# Altium project BMS.PrjPcb
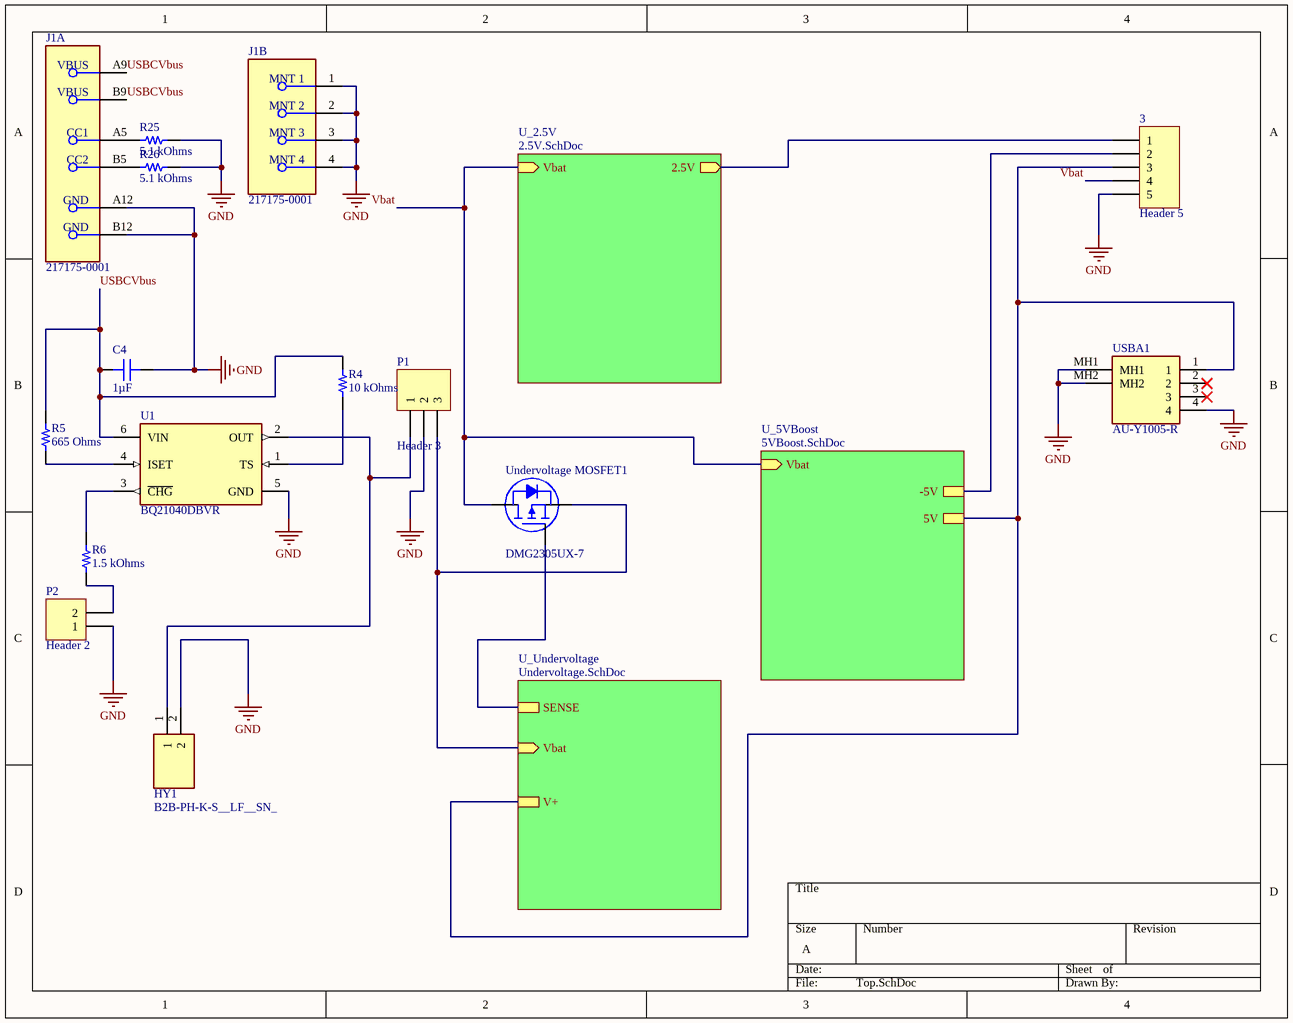
[diagram p0: Top.SchDoc]
4 sheets, 40 parts. Net scope: hierarchical (ports join the sheet entries above them; power ports are global).
Board file: PCB1.PcbDoc
Sheets:
  Top.SchDoc
    U_5VBoost = 5VBoost.SchDoc
    U_Undervoltage = Undervoltage.SchDoc
    U_2.5V = 2.5V.SchDoc

## Sheet Top.SchDoc
size A; SheetNumber: 1; SheetTotal: 4

### Parts
3  Header 5  [HDR1X5]
C4  value 1µF  [CAP 0603_1608]  (hidden comment: 0603YC105MAT2A)
HY1  B2B-PH-K-S__LF__SN_  [B2BPHKSLFSN]
J1  217175-0001  [FP-217175-0001-MFG]  (parts A,B of 2)
P1  Header 3  [HDR1X3]
P2  Header 2  [HDR1X2]
R4  value 10 kOhms  [RES 0603_1608]  (hidden comment: RR0816P-103-D)
R5  value 665 Ohms  [RES 0603_1608]  (hidden comment: RK73H1JTTD6650F)
R6  value 1.5 kOhms  [RES 0603_1608]  (hidden comment: ERA-3AEB152V)
R25  value 5.1 kOhms  [RES 0603_1608]  (hidden comment: AC0603JR-075K1L)
R26  value 5.1 kOhms  [RES 0603_1608]  (hidden comment: AC0603JR-075K1L)
U1  BQ21040DBVR  [FP-DBV0006A-MFG]
Undervoltage_MOSFET1  DMG2305UX-7  [DIODES SOT-23-3]
USBA1  AU-Y1005-R  [AUY1005R]

### Sub-sheets
U_2.5V = 2.5V.SchDoc: Vbat (in), 2.5V (out)
U_5VBoost = 5VBoost.SchDoc: Vbat (in), 5V, -5V
U_Undervoltage = Undervoltage.SchDoc: Vbat (in), SENSE, V+

### Nets
GND: 3.5 C4.2 HY1.2 J1.1(MNT_1) J1.2(MNT_2) J1.3(MNT_3) J1.4(MNT_4) J1.A12(GND) J1.B12(GND) P1.2 P2.1 R25.2 R26.2 U1.5(GND) USBA1.4 USBA1.MH1 USBA1.MH2
USBCVbus: C4.1 J1.A9(VBUS) J1.B9(VBUS) R4.1 R5.2 U1.6(VIN)
Vbat: 3.4 Undervoltage_MOSFET1.3(D) ; sheet U_5VBoost/Vbat, sheet U_2.5V/Vbat
Vout: 3.3 USBA1.1 ; sheet U_5VBoost/5V, sheet U_Undervoltage/V+
Net2.5VBoost_6: 3.1 ; sheet U_2.5V/2.5V
Net3_2: 3.2 ; sheet U_5VBoost/-5V
NetHY1_1: HY1.1 P1.1 U1.2(OUT)
NetJ1_A5: J1.A5(CC1) R25.1
NetJ1_B5: J1.B5(CC2) R26.1
NetP1_3: P1.3 Undervoltage_MOSFET1.2(S) ; sheet U_Undervoltage/Vbat
NetP2_2: P2.2 R6.1
NetR1_1: Undervoltage_MOSFET1.1(G) ; sheet U_Undervoltage/SENSE
NetR4_2: R4.2 U1.1(TS)
NetR5_1: R5.1 U1.4(ISET)
NetR6_2: R6.2 U1.3(~{CHG})

Not connected (* = marked no-connect by the designer): USBA1 2* 3*

### Library data of the parts
3 = CMP-002-000102-1: Header, 5-Pin; Signal Integrity: Connector; LatestRevisionDate: 17-Jul-2002; Source: Miscellaneous Connectors.SchLib; Design Item ID: Header 5; Publisher: Altium Limited; LatestRevisionNote: Re-released for DXP Platform.; Component Type: Standard; Pin Count: 5
C4 = CMP-184-001549-1: CAP CER 1UF 16V X7R 0603; manufacturer: AVX Corporation; Tolerance: ±20%; Part Status: Active; Applications: General Purpose; Operating Temperature: -55°C ~ 125°C; Minimum Order: 1; ComponentLink1URL: http://datasheets.avx.com/X7RDielectric.pdf; partid: 8799; series: -; Mounting Type: Surface Mount, MLCC; Size / Dimension: 0.063" L x 0.032" W (1.60mm x 0.81mm); lastupdated: 9/2/2020 1:03:24 AM; ComponentLink2Description: DigiKey Link; packaging: TapeAndReel; Capacitance: 1µF; price: 0.04; Device Package: 0603 (1608 Metric); Thickness (Max): 0.035" (0.90mm); Voltage - Rated: 16V; ComponentLink1Description: Datasheet; Part Number: 0603YC105MAT2A; Temperature Coefficient: X7R; Package / Case: 0603 (1608 Metric); ComponentLink2URL: http://digikey.com/product-detail/en/avx-corporation/0603YC105MAT2A/478-11645-1-ND/8564203; Lifecycle Status: Active
HY1 = B2B-PH-K-S__LF__SN_: Circulator or Directional Coupler; Manufacturer_Name: JST (JAPAN SOLDERLESS TERMINALS); Manufacturer_Part_Number: B2B-PH-K-S (LF)(SN); Datasheet Link: http://www.jst-mfg.com/product/pdf/eng/ePH.pdf; Height: 6mm
J1 = CMP-04767-000026-1: CONN RCP USB2.0 C 6+18P SMD RA
P1 = CMP-002-000090-1: Header, 3-Pin; Signal Integrity: Connector; Component Type: Standard; LatestRevisionDate: 17-Jul-2002; Publisher: Altium Limited; Design Item ID: Header 3; LatestRevisionNote: Re-released for DXP Platform.; Source: Miscellaneous Connectors.SchLib; Pin Count: 3
P2 = CMP-002-000070-1: Header, 2-Pin; Signal Integrity: Connector; Pin Count: 2; Component Type: Standard; Publisher: Altium Limited; Source: Miscellaneous Connectors.SchLib; LatestRevisionDate: 17-Jul-2002; Design Item ID: Header 2; LatestRevisionNote: Re-released for DXP Platform.
R4 = CMP-289-000281-1: RES SMD 10K OHM 0.5% 1/16W 0603; Manufacturer: Susumu; Power (Watts): 0.063W, 1/16W; Temperature Coefficient: ±25ppm/°C; Device Package: 0603 (1608 Metric); Resistance: 10 kOhms; Number of Terminations: 2; Height - Seated (Max): 0.020" (0.50mm); Composition: Thin Film; Size / Dimension: 0.063" L x 0.031" W (1.60mm x 0.80mm); Series: RR; PartId: 5458; Supplier Device Package: 0603; Part Number: RR0816P-103-D; ComponentLink1Description: Datasheet; Minimum Order: 1; Packaging: TapeAndReel; ComponentLink1URL: http://www.susumu.co.jp/common/pdf/n_catalog_partition05_en.pdf; ComponentLink2URL: https://www.digikey.com/en/products/detail/susumu/RR0816P-103-D/432209; Price: 0.01; LastUpdated: 9/19/2022 1:22:32 PM; Package / Case: 0603 (1608 Metric); Tolerance: ±0.5%; ComponentLink2Description: DigiKey Link; Lifecycle Status: Active; Part Status: Active; Operating Temperature: -55°C ~ 125°C
R5 = CMP-289-001928-1: RES 665 OHM 1% 1/8W 0603; Manufacturer: KOA Speer Electronics, Inc.; Temperature Coefficient: ±100ppm/°C; Power (Watts): 0.125W, 1/8W; Price: 0.01; Minimum Order: 1; Part Status: Active; Composition: Thick Film; Series: RK73H; Operating Temperature: -55°C ~ 155°C; Package / Case: 0603 (1608 Metric); Lifecycle Status: Active; Supplier Device Package: 0603; Height - Seated (Max): 0.022" (0.55mm); Features: Automotive AEC-Q200, Moisture Resistant; Resistance: 665 Ohms; Part Number: RK73H1JTTD6650F; Tolerance: ±1%; Packaging: CutTape; ComponentLink2URL: https://www.digikey.com/en/products/detail/koa-speer-electronics-inc/RK73H1JTTD6650F/9845256; Number of Terminations: 2; LastUpdated: 9/19/2022 1:22:19 PM; Ratings: AEC-Q200; ComponentLink1URL: http://www.koaspeer.com/catimages/Products/RK73H/RK73H.pdf; PartId: 8803; ComponentLink1Description: Datasheet; Device Package: 0603 (1608 Metric); Size / Dimension: 0.063" L x 0.031" W (1.60mm x 0.80mm); ComponentLink2Description: DigiKey Link
R6 = CMP-289-000334-1: RES SMD 1.5K OHM 0.1% 1/10W 0603; Manufacturer: Panasonic Electronic Components; Temperature Coefficient: ±25ppm/°C; Power (Watts): 0.1W, 1/10W; Operating Temperature: -55°C ~ 155°C; Height - Seated (Max): 0.022" (0.55mm); Price: 0.03; Features: Automotive AEC-Q200; Size / Dimension: 0.063" L x 0.031" W (1.60mm x 0.80mm); Lifecycle Status: Active; Supplier Device Package: 0603; Device Package: 0603 (1608 Metric); LastUpdated: 9/19/2022 1:22:32 PM; ComponentLink2Description: DigiKey Link; Tolerance: ±0.1%; Part Number: ERA-3AEB152V; Package / Case: 0603 (1608 Metric); Ratings: AEC-Q200; ComponentLink1Description: Datasheet; Packaging: TapeAndReel; Number of Terminations: 2; ComponentLink1URL: https://industrial.panasonic.com/cdbs/www-data/pdf/RDM0000/AOA0000C307.pdf; Resistance: 1.5 kOhms; Minimum Order: 1; PartId: 5573; ComponentLink2URL: https://www.digikey.com/en/products/detail/panasonic-electronic-components/ERA-3AEB152V/1465858; Composition: Thin Film; Part Status: Active; Series: ERA-3A
R25 R26 = CMP-289-001699-1: RES SMD 5.1K OHM 5% 1/10W 0603; Manufacturer: Yageo; Temperature Coefficient: ±100ppm/°C; Power (Watts): 0.1W, 1/10W; Ratings: AEC-Q200; ComponentLink2Description: DigiKey Link; Packaging: CutTape; Lifecycle Status: Active; Part Number: AC0603JR-075K1L; Resistance: 5.1 kOhms; Supplier Device Package: 0603; LastUpdated: 9/19/2022 1:22:21 PM; ComponentLink2URL: https://www.digikey.com/en/products/detail/yageo/AC0603JR-075K1L/5896480; ComponentLink1URL: https://www.yageo.com/upload/media/product/productsearch/datasheet/rchip/PYu-AC_51_RoHS_L_7.pdf; Part Status: Active; Composition: Thick Film; ComponentLink1Description: Datasheet; Package / Case: 0603 (1608 Metric); Device Package: 0603 (1608 Metric); Height - Seated (Max): 0.022" (0.55mm); Tolerance: ±5%; PartId: 8336; Minimum Order: 1; Price: 0.01; Operating Temperature: -55°C ~ 155°C; Number of Terminations: 2; Series: AC; Features: Automotive AEC-Q200, Moisture Resistant; Size / Dimension: 0.063" L x 0.031" W (1.60mm x 0.80mm)
U1 = CMP-04911-000045-1: IC BATT CHG LI-ION 1CELL SOT23-6; Differential Output: No; Settling Time: 30us; Fault Protection: Over Voltage; Number of Bits: 16; Output Type: Analog Current/Voltage; Interface: USB; Number of Cells: 1; Max Supply Voltage: 6.45V; Battery Pack Voltage: 4.2V; Max Charge Current: 800mA; Number of D/A Converters: 4; Mount: Surface Mount; Case/Package: SOT-23-6; RoHS Compliant: Yes; Packaging: Cut Tape; Min Operating Temperature: 0°C; Lead Free: Lead Free; Max Operating Temperature: 125°C
Undervoltage_MOSFET1 = CMP-258-000005-1: MOSFET P-CH 20V 4.2A SOT23; Manufacturer: Diodes Incorporated; Vgs(th) (Max) @ Id: 900mV @ 250µA; Drive Voltage (Max Rds On,  Min Rds On): 1.8V, 4.5V; Power Dissipation (Max): 1.4W (Ta); Rds On (Max) @ Id, Vgs: 52mOhm @ 4.2A, 4.5V; Vgs (Max): ±8V; Input Capacitance (Ciss) (Max) @ Vds: 808pF @ 15V; Current - Continuous Drain (Id) @ 25°C: 4.2A (Ta); Gate Charge (Qg) (Max) @ Vgs: 10.2nC @ 4.5V; FET Type: P-Channel; Minimum Order: 1; Part Number: DMG2305UX-7; Supplier Device Package: SOT-23; Price: 0.07; Drain to Source Voltage (Vdss): 20V; LastUpdated: 9/19/2022 2:00:16 PM; Packaging: TapeAndReel; Mounting Type: Surface Mount; ComponentLink2Description: DigiKey Link; Part Status: Active; ComponentLink2URL: http://digikey.com/product-detail/en/diodes-incorporated/DMG2305UX-7/DMG2305UX-7DICT-ND/4340665; Package / Case: TO-236-3, SC-59, SOT-23-3; Series: -; Lifecycle Status: Active; Technology: MOSFET (Metal Oxide); ComponentLink1URL: https://www.diodes.com/assets/Datasheets/DMG2305UX.pdf; Operating Temperature: -55°C ~ 150°C (TJ); ComponentLink1Description: Datasheet
USBA1 = AU-Y1005-R: Connector; Manufacturer_Name: ASSMANN WSW components GmbH; Datasheet Link: http://media.digikey.com/pdf/Data%20Sheets/Assmann%20PDFs/AU-Y1005-R_Dwg.pdf; Height: 7.8mm; Manufacturer_Part_Number: AU-Y1005-R

## Sheet 5VBoost.SchDoc
size A; SheetNumber: 2; SheetTotal: 4
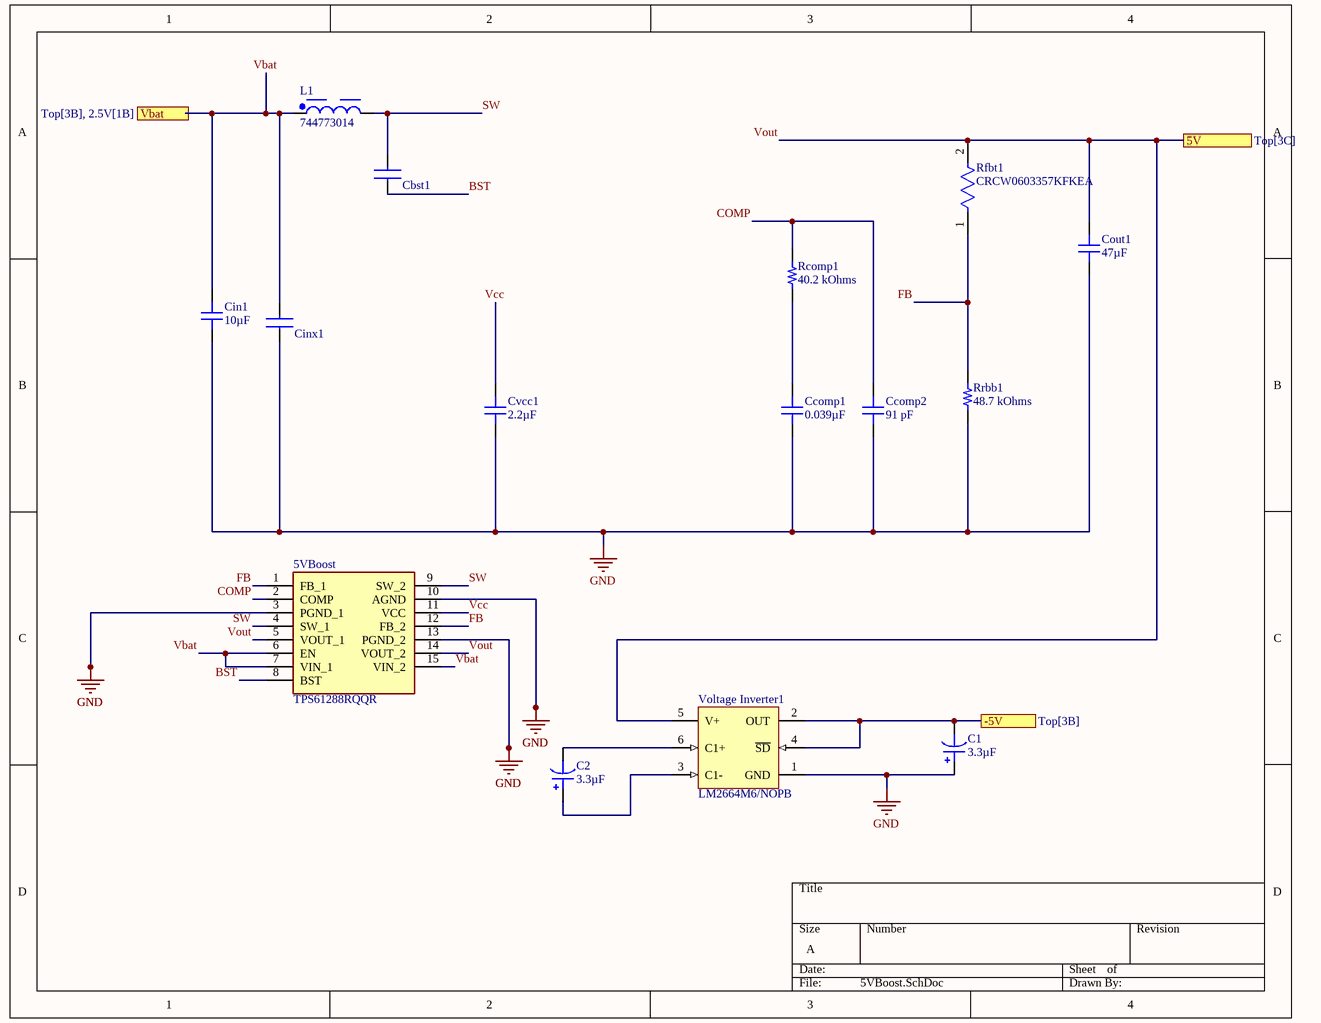
[diagram p1: 5VBoost.SchDoc]

### Parts
5VBoost  TPS61288RQQR  [TPS61288RQQR]
C1  value 3.3µF  [CAP POL 1411_3528]  (hidden comment: SCTB335K16)
C2  value 3.3µF  [CAP POL 1411_3528]  (hidden comment: SCTB335K16)
Cbst1  Capacitor 100nF 0603  [CAPC1608X90N]  (value not drawn)
Ccomp1  value 0.039µF  [CAP 0603_1608]  (hidden comment: 06035C393JAT2A)
Ccomp2  value 91 pF  [CAP 0603_1608]  (hidden comment: C0603C910J1GAC7867)
Cin1  value 10µF  [CAP 0603_1608]  (hidden comment: 06036D106KAT2A)
Cinx1  Capacitor 100nF 0603  [CAPC1608X90N]  (value not drawn)
Cout1  value 47µF  [CAP 0603_1608]  (hidden comment: 06036D476MAT2A)
Cvcc1  value 2.2µF  [CAP 0603_1608]  (hidden comment: 0603YD225KAT2A)
L1  744773014  [WE-PD2_4532]
Rcomp1  value 40.2 kOhms  [RES 0603_1608]  (hidden comment: RT0603DRE0740K2L)
Rfbt1  CRCW0603357KFKEA  [FP-CRCW0603-e3-IPC_C]
Rrbb1  value 48.7 kOhms  [RES 0603_1608]  (hidden comment: CPF0603F48K7C1)
Voltage_Inverter1  LM2664M6/NOPB  [DBV0006A_L]

### Ports
5V (see Top[3C]), -5V (see Top[3B]), Vbat (in, see Top[3B], 2.5V[1B])

### Nets
GND: 5VBoost.3(PGND_1) 5VBoost.10(AGND) 5VBoost.13(PGND_2) C1.1 Ccomp1.1 Ccomp2.1 Cin1.1 Cinx1.1 Cout1.1 Cvcc1.1 Rrbb1.1 Voltage_Inverter1.1(GND)
BST: 5VBoost.8(BST) Cbst1.1
COMP: 5VBoost.2(COMP) Ccomp2.2 Rcomp1.2
FB: 5VBoost.1(FB_1) 5VBoost.12(FB_2) Rfbt1.1 Rrbb1.2
SW: 5VBoost.4(SW_1) 5VBoost.9(SW_2) Cbst1.2 L1.2
Vbat: 5VBoost.6(EN) 5VBoost.7(VIN_1) 5VBoost.15(VIN_2) Cin1.2 Cinx1.2 L1.1 ; port Vbat
Vcc: 5VBoost.11(VCC) Cvcc1.2
Vout: 5VBoost.5(VOUT_1) 5VBoost.14(VOUT_2) Cout1.2 Rfbt1.2 Voltage_Inverter1.5(V+) ; port 5V
Net3_2: C1.2 Voltage_Inverter1.2(OUT) Voltage_Inverter1.4(~{SD}) ; port -5V
NetC2_1: C2.1 Voltage_Inverter1.3(C1-)
NetC2_2: C2.2 Voltage_Inverter1.6(C1+)
NetCcomp1_2: Ccomp1.2 Rcomp1.1

### Library data of the parts
5VBoost = TPS61288RQQR: Integrated Circuit; Manufacturer_Name: Texas Instruments; Datasheet Link: https://www.ti.com/lit/ds/symlink/tps61288.pdf?ts=1609351344517&ref_url=https%253A%252F%252Fwww.ti.com%252Fpower-management%252Fnon-isolated-dc-dc-switching-regulators%252Fstep-up-boost%252Fboost-converters-integrated-switch%252Fproducts.html; Height: 1mm; Manufacturer_Part_Number: TPS61288RQQR; Mouser Part Number: 595-TPS61288RQQR; Mouser Price/Stock: https://www.mouser.co.uk/ProductDetail/Texas-Instruments/TPS61288RQQR?qs=eP2BKZSCXI7ZX8saYJkaIw%3D%3D; Arrow Part Number: TPS61288RQQR; Arrow Price/Stock: https://www.arrow.com/en/products/tps61288rqqr/texas-instruments?utm_currency=USD&region=nac
C1 C2 = CMP-192-003656-1: CAP-TANT SM 3.3UF 16V; Manufacturer Size Code: B; manufacturer: NTE Electronics, Inc; Tolerance: ±10%; Type: Molded; series: SCT; Size / Dimension: 0.138" L x 0.110" W (3.50mm x 2.80mm); ComponentLink2URL: http://digikey.com/product-detail/en/nte-electronics-inc/SCTB335K16/2368-SCTB335K16-ND/11646299; lastupdated: 8/30/2020 8:55:00 PM; Features: General Purpose; price: 0.56; Mounting Type: Surface Mount; packaging: Bag; ComponentLink1URL: https://www.nteinc.com/capacitor_web/pdf/sct.pdf; partid: 3657; Minimum Order: 5; Height - Seated (Max): 0.083" (2.10mm); ComponentLink2Description: DigiKey Link; Package / Case: 1411 (3528 Metric), 1210; Part Number: SCTB335K16; Lifecycle Status: Active; ComponentLink1Description: Datasheet; Capacitance: 3.3µF
Cbst1 Cinx1 = CMP-002-000221-3: TDK - CGA3E2X7R1H104K080AA Multilayer Ceramic Capacitors MLCC - SMD/SMT CGA 0603 50V 0.1uF X7R 10% AEC-Q200; Manufacturer_Name: TDK; Datasheet Link: https://componentsearchengine.com//CGA3E2X7R1H104K080AA.pdf; Manufacturer_Part_Number: CGA3E2X7R1H104K080AA; Design Item ID: CGA3E2X7R1H104K080AA; Height: 0.9mm; Source: CGA3E2X7R1H104K080AA.SchLib; Mouser2 Price/Stock: https://www.mouser.com/Search/Refine.aspx?Keyword=810-CGA3E2X7R1H104K; Mouser2 Part Number: 810-CGA3E2X7R1H104K
Ccomp1 = CMP-184-000491-1: CAP CER 0.039UF 50V X7R 0603; manufacturer: AVX Corporation; Tolerance: ±5%; lastupdated: 9/2/2020 1:03:32 AM; Size / Dimension: 0.063" L x 0.032" W (1.60mm x 0.81mm); Part Status: Active; Lifecycle Status: Active; Package / Case: 0603 (1608 Metric); Voltage - Rated: 50V; ComponentLink2Description: DigiKey Link; Part Number: 06035C393JAT2A; ComponentLink2URL: http://digikey.com/product-detail/en/avx-corporation/06035C393JAT2A/478-10354-1-ND/6797293; Capacitance: 0.039µF; Device Package: 0603 (1608 Metric); Temperature Coefficient: X7R; Applications: General Purpose; partid: 4146; series: -; ComponentLink1URL: http://datasheets.avx.com/X7RDielectric.pdf; packaging: TapeAndReel; ComponentLink1Description: Datasheet; Operating Temperature: -55°C ~ 125°C; Thickness (Max): 0.035" (0.90mm); Minimum Order: 1; price: 0.08; Mounting Type: Surface Mount, MLCC
Ccomp2 = CMP-184-001276-1: CAP CER 91PF 100V C0G/NP0 0603; manufacturer: KEMET; Tolerance: ±5%; Temperature Coefficient: C0G, NP0; Lifecycle Status: Active; ComponentLink2URL: https://www.digikey.com/en/products/detail/kemet/C0603C910J1GAC7867/7382113; Mounting Type: Surface Mount, MLCC; ComponentLink2Description: DigiKey Link; Package / Case: 0603 (1608 Metric); series: SMD Comm C0G; ComponentLink1URL: https://api.kemet.com/component-edge/download/datasheet/C0603C910J1GAC7867.pdf; Part Status: Active; partid: 7603; price: 0.06; Minimum Order: 1; lastupdated: 9/19/2022 1:01:05 PM; Part Number: C0603C910J1GAC7867; Voltage - Rated: 100V; Size / Dimension: 0.063" L x 0.031" W (1.60mm x 0.80mm); Features: Low ESL; packaging: TapeAndReel; Capacitance: 91 pF; ComponentLink1Description: Datasheet; Operating Temperature: -55°C ~ 125°C; Applications: General Purpose; Device Package: 0603 (1608 Metric); Thickness (Max): 0.034" (0.87mm)
Cin1 = CMP-184-001573-1: CAP CER 10UF 6.3V X5R 0603; manufacturer: AVX Corporation; Tolerance: ±10%; Part Number: 06036D106KAT2A; lastupdated: 9/2/2020 1:03:24 AM; Voltage - Rated: 6.3V; Part Status: Active; price: 0.45; ComponentLink2URL: http://digikey.com/product-detail/en/avx-corporation/06036D106KAT2A/478-7932-1-ND/3881555; Size / Dimension: 0.063" L x 0.032" W (1.60mm x 0.81mm); ComponentLink1URL: http://datasheets.avx.com/cx5r.pdf; packaging: TapeAndReel; Device Package: 0603 (1608 Metric); partid: 8872; Thickness (Max): 0.035" (0.90mm); series: -; Minimum Order: 1; ComponentLink2Description: DigiKey Link; Capacitance: 10µF; Operating Temperature: -55°C ~ 85°C; Temperature Coefficient: X5R; Package / Case: 0603 (1608 Metric); Applications: General Purpose; ComponentLink1Description: Datasheet; Lifecycle Status: Active; Mounting Type: Surface Mount, MLCC
Cout1 = CMP-184-002058-1: CAP CER 47UF 6.3V X5R 0603; manufacturer: AVX Corporation; Tolerance: ±20%; Part Status: Active; Mounting Type: Surface Mount, MLCC; Minimum Order: 1; packaging: TapeAndReel; ComponentLink2URL: http://digikey.com/product-detail/en/avx-corporation/06036D476MAT2A/478-11180-1-ND/7563130; price: 0.41; lastupdated: 9/2/2020 1:03:20 AM; ComponentLink1URL: http://datasheets.avx.com/cx5r.pdf; Device Package: 0603 (1608 Metric); Voltage - Rated: 6.3V; series: -; ComponentLink2Description: DigiKey Link; ComponentLink1Description: Datasheet; partid: 11014; Size / Dimension: 0.063" L x 0.031" W (1.60mm x 0.80mm); Applications: General Purpose; Temperature Coefficient: X5R; Capacitance: 47µF; Operating Temperature: -55°C ~ 85°C; Part Number: 06036D476MAT2A; Package / Case: 0603 (1608 Metric); Lifecycle Status: Active
Cvcc1 = CMP-184-002158-1: CAP CER 2.2UF 16V X5R 0603; manufacturer: AVX Corporation; Tolerance: ±10%; Device Package: 0603 (1608 Metric); Package / Case: 0603 (1608 Metric); series: -; price: 0.19; Operating Temperature: -55°C ~ 85°C; Part Status: Active; Lifecycle Status: Active; packaging: TapeAndReel; Minimum Order: 1; ComponentLink2Description: DigiKey Link; Voltage - Rated: 16V; Part Number: 0603YD225KAT2A; ComponentLink1Description: Datasheet; partid: 11466; Applications: General Purpose; ComponentLink2URL: http://digikey.com/product-detail/en/avx-corporation/0603YD225KAT2A/478-5147-1-ND/1913237; Mounting Type: Surface Mount, MLCC; Temperature Coefficient: X5R; lastupdated: 9/2/2020 1:03:19 AM; ComponentLink1URL: http://datasheets.avx.com/cx5r.pdf; Thickness (Max): 0.035" (0.90mm); Capacitance: 2.2µF; Size / Dimension: 0.063" L x 0.032" W (1.60mm x 0.81mm)
L1 = CMP-0227-00478-2: NexarPartId: 24533326; Self Resonant Frequency: 103MHz; Inductance: 1.4µH; DC Resistance (DCR): 22mΩ; RMS Current (Irms): 3.4A; Inductance Tolerance: 20%; Saturation Current: 5.04A; Core Material: Ferrite; Test Frequency: 10kHz; Resistance: 56mΩ; Shielding: Unshielded; Min Operating Temperature: -40°C; Length: 4mm; Ambient Temperature Range Low: -40°C; Lead Free: Lead Free; Ambient Temperature Range High: 85°C; Case/Package: Nonstandard; REACH SVHC: Unknown; Width: 4.5mm; Max Operating Temperature: 125°C; Height: 3.2mm; Height - Seated (Max): 3.5052mm; RoHS: Compliant; Mount: Surface Mount; Tolerance: 20%; Composition: Wirewound; Current Rating: 3.4A; Max DC Current: 3.4A; Termination: SMD/SMT; Packaging: Digi-Reel®
Rcomp1 = CMP-289-002489-1: RES SMD 40.2KOHM 0.5% 1/10W 0603; Manufacturer: Yageo; Power (Watts): 0.1W, 1/10W; Temperature Coefficient: ±50ppm/°C; Supplier Device Package: 0603; Height - Seated (Max): 0.022" (0.55mm); Composition: Thin Film; Size / Dimension: 0.063" L x 0.031" W (1.60mm x 0.80mm); Packaging: TapeAndReel; Series: RT; Resistance: 40.2 kOhms; Minimum Order: 1; PartId: 9988; ComponentLink1URL: https://www.yageo.com/upload/media/product/productsearch/datasheet/rchip/PYu-RT_1-to-0.01_RoHS_L_11.pdf; Number of Terminations: 2; Part Number: RT0603DRE0740K2L; Device Package: 0603 (1608 Metric); Price: 0.01; Operating Temperature: -55°C ~ 155°C; ComponentLink2Description: DigiKey Link; Tolerance: ±0.5%; Part Status: Active; ComponentLink2URL: https://www.digikey.com/en/products/detail/yageo/RT0603DRE0740K2L/1074850; LastUpdated: 9/19/2022 1:22:15 PM; Lifecycle Status: Active; ComponentLink1Description: Datasheet; Package / Case: 0603 (1608 Metric)
Rfbt1 = CMP-2000-03262-2: RES Thick Film, 357kΩ, 1%, 0.1W, 100ppm/°C, 0603; Max Power Dissipation: 100mW; Voltage Rating (DC): 75V; Resistance: 357kR; Packaging: Tape and Reel; Min Operating Temperature: -55°C; Max Operating Temperature: 155°C; Number of Pins: 2; Length: 1.55mm; Case Code (Imperial): 0603; Number of Terminations: 2; Military Standard: Not; Width: 0.033inch; Case Code (Metric): 1608; Termination: Solder; Radiation Hardening: No; Power Rating: 100mW; Depth: 0.85mm; Voltage Rating: 75V; Height: 0.45mm; Case/Package: 0603; Package Quantity: 10; Composition: Thick Film; Weight: 7.1E-05oz; Features: Automotive AEC-Q200; Lead Free: Lead Free; Tolerance: 1%; Temperature Coefficient: 100ppm/°C; Contact Plating: Tin
Rrbb1 = CMP-289-001065-1: RES SMD 48.7K OHM 1% 1/16W 0603; Manufacturer: TE Connectivity Passive Product; Temperature Coefficient: ±50ppm/°C; Power (Watts): 0.063W, 1/16W; ComponentLink2Description: DigiKey Link; ComponentLink1Description: Datasheet; Tolerance: ±1%; PartId: 7053; Composition: Thin Film; Size / Dimension: 0.061" L x 0.031" W (1.55mm x 0.80mm); Operating Temperature: -55°C ~ 155°C; LastUpdated: 9/19/2022 1:22:26 PM; Part Number: CPF0603F48K7C1; Resistance: 48.7 kOhms; Price: 0.02; Part Status: Active; Height - Seated (Max): 0.022" (0.55mm); Device Package: 0603 (1608 Metric); Series: CPF, Neohm; Package / Case: 0603 (1608 Metric); Number of Terminations: 2; Minimum Order: 1; Lifecycle Status: Active; Packaging: TapeAndReel; Supplier Device Package: 0603; ComponentLink2URL: https://www.digikey.com/en/products/detail/te-connectivity-passive-product/CPF0603F48K7C1/2384648; ComponentLink1URL: https://www.te.com/commerce/DocumentDelivery/DDEController?Action=srchrtrv&DocNm=1773200&DocType=DS&DocLang=English
Voltage_Inverter1 = CMP-0065-00094-3: Switched Capacitor Voltage Converter, 6-pin SOT-23, Pb-Free; Manufacturer: Texas Instruments; PackageTopMarking: S03A*XTT; CompType: Switch Caps; PowerWise: N; PackageDescription: Molded SOT-23, .115 x .063 x .040in Body, 6 Lead, .0375in in Pitch; PackageReference: DBV0006A; ComponentLink1URL: http://www.ti.com/general/docs/lit/getliterature.tsp?genericPartNumber=LM2664&fileType=pdf; ComponentLink1Description: Datasheet URL; Code_IPC: SOT26A-6; RoHS: Y; PinCount: 6; Code_JEDEC: MO-178-AB

## Sheet Undervoltage.SchDoc
size A; SheetNumber: 4; SheetTotal: 4
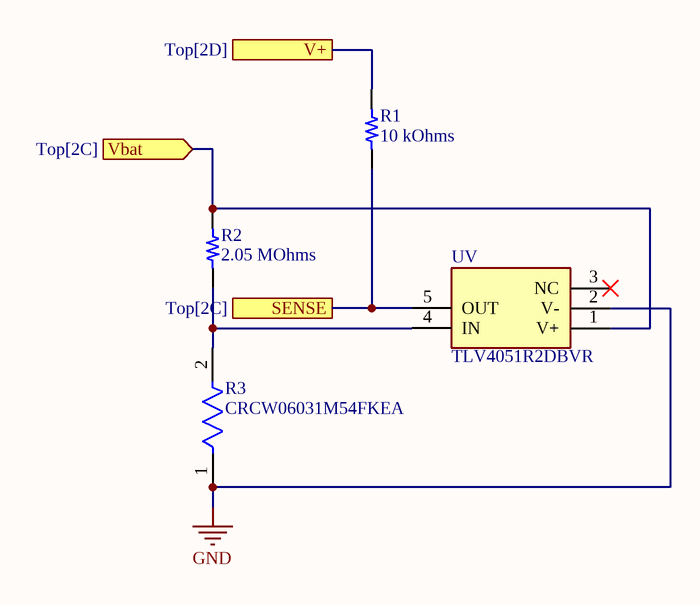
[diagram p2: Undervoltage.SchDoc]

### Parts
R1  value 10 kOhms  [RES 0603_1608]  (hidden comment: RR0816P-103-D)
R2  value 2.05 MOhms  [RES 0603_1608]  (hidden comment: RMCF0603FT2M05)
R3  CRCW06031M54FKEA  [FP-CRCW0603-e3-IPC_B]
UV  TLV4051R2DBVR  [SOT95P280X145-5N]

### Ports
SENSE (see Top[2C]), V+ (see Top[2D]), Vbat (in, see Top[2C])

### Nets
GND: R3.1 UV.2(V-)
Vout: R1.2 ; port V+
NetP1_3: R2.2 UV.1(V+) ; port Vbat
NetR1_1: R1.1 UV.5(OUT) ; port SENSE
NetR2_1: R2.1 R3.2 UV.4(IN)

Not connected (* = marked no-connect by the designer): UV 3(NC)*

### Library data of the parts
R1 = CMP-289-000281-1: as R4 on sheet Top; Device Package: 0603 (1608 Metric); Resistance: 10 kOhms; Number of Terminations: 2; Height - Seated (Max): 0.020" (0.50mm); Composition: Thin Film; Size / Dimension: 0.063" L x 0.031" W (1.60mm x 0.80mm); Series: RR; PartId: 5458; Supplier Device Package: 0603; Part Number: RR0816P-103-D; ComponentLink1Description: Datasheet; Minimum Order: 1; Packaging: TapeAndReel; ComponentLink1URL: http://www.susumu.co.jp/common/pdf/n_catalog_partition05_en.pdf; ComponentLink2URL: https://www.digikey.com/en/products/detail/susumu/RR0816P-103-D/432209; Price: 0.01; LastUpdated: 9/19/2022 1:22:32 PM; Package / Case: 0603 (1608 Metric); Tolerance: ±0.5%; ComponentLink2Description: DigiKey Link; Lifecycle Status: Active; Part Status: Active; Operating Temperature: -55°C ~ 125°C
R2 = CMP-289-001020-1: RES 2.05M OHM 1% 1/10W 0603; Manufacturer: Stackpole Electronics Inc; Power (Watts): 0.1W, 1/10W; Temperature Coefficient: ±200ppm/°C; Series: RMCF; Part Number: RMCF0603FT2M05; Lifecycle Status: Active; Device Package: 0603 (1608 Metric); Number of Terminations: 2; ComponentLink2Description: DigiKey Link; Price: 0.01; Minimum Order: 1; Part Status: Active; Resistance: 2.05 MOhms; Ratings: AEC-Q200; PartId: 6967; Features: Automotive AEC-Q200; ComponentLink2URL: https://www.digikey.com/en/products/detail/stackpole-electronics-inc/RMCF0603FT2M05/1713706; LastUpdated: 9/19/2022 1:22:26 PM; ComponentLink1URL: https://www.seielect.com/catalog/sei-rmcf_rmcp.pdf; Composition: Thick Film; ComponentLink1Description: Datasheet; Supplier Device Package: 0603; Size / Dimension: 0.061" L x 0.031" W (1.55mm x 0.80mm); Height - Seated (Max): 0.022" (0.55mm); Package / Case: 0603 (1608 Metric); Operating Temperature: -55°C ~ 155°C; Packaging: CutTape; Tolerance: ±1%
R3 = CMP-02407-002537-1: RES Thick Film, 1.54MΩ, 1%, 0.1W, 100ppm/°C, 0603; Voltage Rating: 75V; Max Power Dissipation: 100mW; Resistance: 1.54MR; Min Operating Temperature: -55°C; Height: 0.02inch; Composition: Thick Film; Weight: 7.1E-05oz; Width: 0.85mm; Depth: 0.85mm; Case Code (Imperial): 0603; Power Rating: 100mW; Contact Plating: Tin; Packaging: Tape and Reel; Lead Free: Lead Free; Length: 1.55mm; Tolerance: 1%; Package Quantity: 10; Temperature Coefficient: 100ppm/°C; Features: Automotive AEC-Q200; Case/Package: 0603; Military Standard: Not; Number of Pins: 2; Termination: SMD/SMT; Number of Terminations: 2; Max Operating Temperature: 155°C; Case Code (Metric): 1608; Radiation Hardening: No; Voltage Rating (DC): 75V
UV = TLV4051R2DBVR: Integrated Circuit; Manufacturer_Name: Texas Instruments; Datasheet Link: https://www.ti.com/product/TLV4051; Height: 1.45mm; Manufacturer_Part_Number: TLV4051R2DBVR

## Sheet 2.5V.SchDoc
size A; SheetNumber: 3; SheetTotal: 4
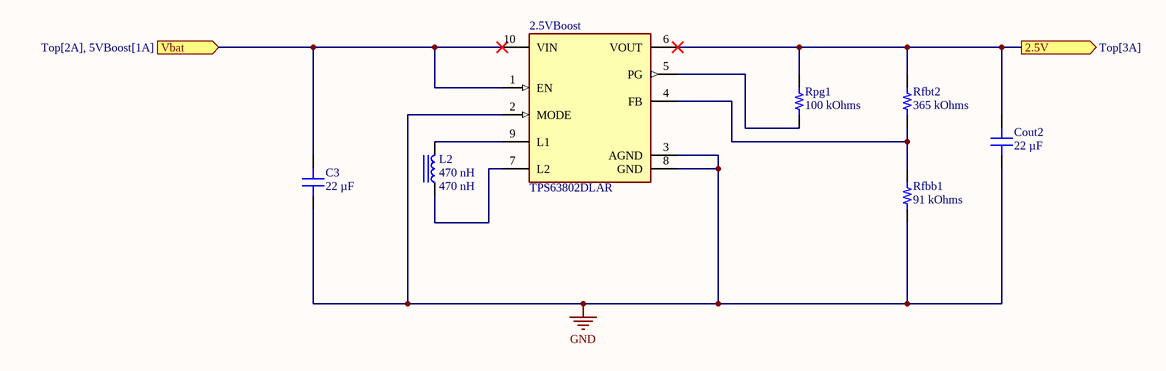
[diagram p3: 2.5V.SchDoc]

### Parts
2.5VBoost  TPS63802DLAR  [FP-DLA0010A-MFG]
C3  value 22 µF  [CAP 0603_1608]  (hidden comment: CL10A226MPCNUBE)
Cout2  value 22 µF  [CAP 0603_1608]  (hidden comment: CL10A226MPCNUBE)
L2  value 470 nH  [BOURNS SRP5030T]  (hidden comment: SRP5030T-R47M)
Rfbb1  value 91 kOhms  [RES 0603_1608]  (hidden comment: ERJ-PA3F9102V)
Rfbt2  value 365 kOhms  [RES 0603_1608]  (hidden comment: RC0603FR-07365KL)
Rpg1  value 100 kOhms  [RES 0603_1608]  (hidden comment: RK73B1JTTD104J)

### Ports
2.5V (out, see Top[3A]), Vbat (in, see Top[2A], 5VBoost[1A])

### Nets
GND: 2.5VBoost.2(MODE) 2.5VBoost.3(AGND) 2.5VBoost.8(GND) C3.1 Cout2.1 Rfbb1.1
Vbat: 2.5VBoost.1(EN) 2.5VBoost.10(VIN) C3.2 ; port Vbat
Net2.5VBoost_4: 2.5VBoost.4(FB) Rfbb1.2 Rfbt2.1
Net2.5VBoost_5: 2.5VBoost.5(PG) Rpg1.1
Net2.5VBoost_6: 2.5VBoost.6(VOUT) Cout2.2 Rfbt2.2 Rpg1.2 ; port 2.5V
Net2.5VBoost_7: 2.5VBoost.7(L2) L2.1
Net2.5VBoost_9: 2.5VBoost.9(L1) L2.2

### Library data of the parts
2.5VBoost = CMP-04918-000005-1: IC POWER MANAGEMENT; Manufacturer: Texas Instruments; Nominal Supply Current: 11uA; Max Junction Temp: +125°C; Max Supply Voltage: 5.5V; Switching Topology: Buck-Boost; Min Supply Voltage: 1.3V; Output Current: 2A; Output Voltage: 1.8-5.2V; Number Of Outputs: 1; Switching Frequency: 1.4/1.6/2.1MHz; Description: 2-A, High-efficient, Low IQ Buck-boost Converter in DFN Package; Standoff Height: 0mm; Max Duty Cycle: 100%; Output Type: AdjustableProgrammable; Manufacturer Part Number: TPS63802DLAR; ComponentLink2URL: https://www.ti.com/lit/ds/symlink/tps63802.pdf; Digikey Description: IC POWER MANAGEMENT; Octopart: https://octopart.com/tps63802dlar-texas+instruments-97359678; Height: 1mm; Temperature: -40°C to +125°C; Device Class L3: Voltage Regulators - Switching; Lead Free: Yes; Category: IC; Mouser Description: 2-A, high-efficient, 11-µA quiescent current buck-boost converter in QFN/DFN package 10-VSON-HR -40 to 125; ComponentLink2Description: Datasheet; Temperature Range Low: -40°C; Temperature Range High: +125°C; Automotive: No; Device Class L2: Power Management ICs; RoHS: TRUE; Device Class L1: Integrated Circuits (ICs); Package: DLA0010A
C3 Cout2 = CMP-184-000455-1: CAP CER 22UF 10V X5R 0603; manufacturer: Samsung Electro-Mechanics; Tolerance: ±20%; series: CL; Applications: General Purpose; Operating Temperature: -55°C ~ 85°C; Mounting Type: Surface Mount, MLCC; Thickness (Max): 0.037" (0.95mm); ComponentLink2Description: DigiKey Link; Lifecycle Status: Active; Size / Dimension: 0.063" L x 0.031" W (1.60mm x 0.80mm); partid: 3985; lastupdated: 9/19/2022 1:01:15 PM; Device Package: 0603 (1608 Metric); ComponentLink2URL: https://www.digikey.com/en/products/detail/samsung-electro-mechanics/CL10A226MPCNUBE/5960988; Temperature Coefficient: X5R; Package / Case: 0603 (1608 Metric); price: 0.06; Part Status: Active; Part Number: CL10A226MPCNUBE; Capacitance: 22 µF; packaging: TapeAndReel; Minimum Order: 1; Voltage - Rated: 10V; ComponentLink1Description: Datasheet; ComponentLink1URL: http://www.samsungsem.com/kr/support/product-search/mlcc/CL10A226MPCNUBE.jsp
L2 = CMP-236-000004-1: FIXED IND 470NH 12A 7.4 MOHM SMD; Manufacturer: Bourns Inc.; DC Resistance (DCR): 7.4mOhm Max; Inductance Frequency - Test: 100 kHz; Type: Drum Core, Wirewound; Material - Core: Iron Powder; Tolerance: ±20%; Current - Saturation: 16A; Shielding: Shielded; PartId: 5; ComponentLink2Description: DigiKey Link; ComponentLink2URL: https://www.digikey.com/en/products/detail/bourns-inc/SRP5030T-R47M/3986077; Series: SRP5030T; Minimum Order: 1; Part Status: Active; Current Rating (Amps): 12 A; Size / Dimension: 0.224" L x 0.205" W (5.70mm x 5.20mm); ComponentLink1Description: Datasheet; Price: 0.63; Device Package: Nonstandard; Inductance: 470 nH; Height - Seated (Max): 0.118" (3.00mm); ComponentLink1URL: https://www.bourns.com/docs/Product-Datasheets/SRP5030T.pdf; LastUpdated: 9/19/2022 1:52:24 PM; Packaging: TapeAndReel; Lifecycle Status: Active; Package / Case: Nonstandard; Mounting Type: Surface Mount; Part Number: SRP5030T-R47M; Operating Temperature: -40°C ~ 125°C
Rfbb1 = CMP-289-001040-1: RES SMD 91K OHM 1% 1/4W 0603; Manufacturer: Panasonic Electronic Components; Power (Watts): 0.25W, 1/4W; Temperature Coefficient: ±100ppm/°C; Minimum Order: 1; Number of Terminations: 2; ComponentLink1Description: Datasheet; Resistance: 91 kOhms; Series: ERJ-PA3; ComponentLink1URL: https://industrial.panasonic.com/cdbs/www-data/pdf/RDO0000/AOA0000C331.pdf; Part Status: Active; Price: 0.02; ComponentLink2Description: DigiKey Link; Lifecycle Status: Active; Operating Temperature: -55°C ~ 155°C; Ratings: AEC-Q200; LastUpdated: 9/19/2022 1:22:26 PM; Features: Automotive AEC-Q200, Pulse Withstanding; Tolerance: ±1%; PartId: 7007; Size / Dimension: 0.063" L x 0.031" W (1.60mm x 0.80mm); Supplier Device Package: 0603; ComponentLink2URL: https://www.digikey.com/en/products/detail/panasonic-electronic-components/ERJ-PA3F9102V/5035965; Package / Case: 0603 (1608 Metric); Device Package: 0603 (1608 Metric); Packaging: TapeAndReel; Height - Seated (Max): 0.022" (0.55mm); Part Number: ERJ-PA3F9102V; Composition: Thick Film
Rfbt2 = CMP-289-001331-1: RES 365K OHM 1% 1/10W 0603; Manufacturer: Yageo; Temperature Coefficient: ±100ppm/°C; Power (Watts): 0.1W, 1/10W; Size / Dimension: 0.063" L x 0.031" W (1.60mm x 0.80mm); Tolerance: ±1%; ComponentLink1URL: https://www.yageo.com/upload/media/product/productsearch/datasheet/rchip/PYu-RC_Group_51_RoHS_L_10.pdf; Number of Terminations: 2; Series: RC_L; PartId: 7601; Operating Temperature: -55°C ~ 155°C; Resistance: 365 kOhms; Device Package: 0603 (1608 Metric); Part Number: RC0603FR-07365KL; Packaging: CutTape; Package / Case: 0603 (1608 Metric); ComponentLink2Description: DigiKey Link; Composition: Thick Film; Supplier Device Package: 0603; LastUpdated: 9/19/2022 1:22:24 PM; ComponentLink2URL: https://www.digikey.com/en/products/detail/yageo/RC0603FR-07365KL/727185; Lifecycle Status: Active; Height - Seated (Max): 0.022" (0.55mm); ComponentLink1Description: Datasheet; Part Status: Active; Features: Moisture Resistant; Price: 0.01; Minimum Order: 1
Rpg1 = CMP-289-000475-1: RES 100K OHM 5% 1/10W 0603; Manufacturer: KOA Speer Electronics, Inc.; Temperature Coefficient: ±200ppm/°C; Power (Watts): 0.1W, 1/10W; Ratings: AEC-Q200; Series: RK73B; Size / Dimension: 0.063" L x 0.031" W (1.60mm x 0.80mm); Features: Automotive AEC-Q200; ComponentLink2Description: DigiKey Link; Composition: Thick Film; Resistance: 100 kOhms; Tolerance: ±5%; Height - Seated (Max): 0.022" (0.55mm); Minimum Order: 1; ComponentLink1Description: Datasheet; Operating Temperature: -55°C ~ 155°C; Part Number: RK73B1JTTD104J; Supplier Device Package: 0603; Packaging: CutTape; ComponentLink1URL: http://www.koaspeer.com/catimages/Products/RK73B/RK73B.pdf; Part Status: Active; Number of Terminations: 2; LastUpdated: 9/19/2022 1:22:31 PM; Package / Case: 0603 (1608 Metric); Device Package: 0603 (1608 Metric); Price: 0.01; ComponentLink2URL: https://www.digikey.com/en/products/detail/koa-speer-electronics-inc/RK73B1JTTD104J/9844700; Lifecycle Status: Active; PartId: 5870

## Nets that join several sheets
GND: Top (17 pins), 5VBoost (12 pins), Undervoltage (R3.1 UV.2), 2.5V (6 pins)
Net2.5VBoost_6: Top (3.1), 2.5V (2.5VBoost.6 Cout2.2 Rfbt2.2 Rpg1.2)
Net3_2: Top (3.2), 5VBoost (C1.2 Voltage_Inverter1.2 Voltage_Inverter1.4)
NetP1_3: Top (P1.3 Undervoltage_MOSFET1.2), Undervoltage (R2.2 UV.1)
NetR1_1: Top (Undervoltage_MOSFET1.1), Undervoltage (R1.1 UV.5)
Vbat: Top (3.4 Undervoltage_MOSFET1.3), 5VBoost (6 pins), 2.5V (2.5VBoost.1 2.5VBoost.10 C3.2)
Vout: Top (3.3 USBA1.1), 5VBoost (5 pins), Undervoltage (R1.2)